# Altium schematic sheet Ports_connector.SchDoc
size A4; SheetNumber: 9; SheetTotal: 9
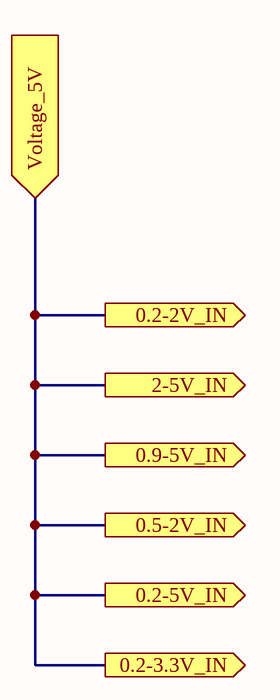
[diagram p0: Ports_connector.SchDoc]

## Ports
0.2-2V_IN (out), 0.2-3.3V_IN (out), 0.2-5V_IN (out), 0.5-2V_IN (out), 0.9-5V_IN (out), 2-5V_IN (out), Voltage_5V (in)

## Nets
0.2-2V_IN: port Voltage_5V, port 0.2-2V_IN, port 2-5V_IN, port 0.9-5V_IN, port 0.5-2V_IN, port 0.2-5V_IN, port 0.2-3.3V_IN